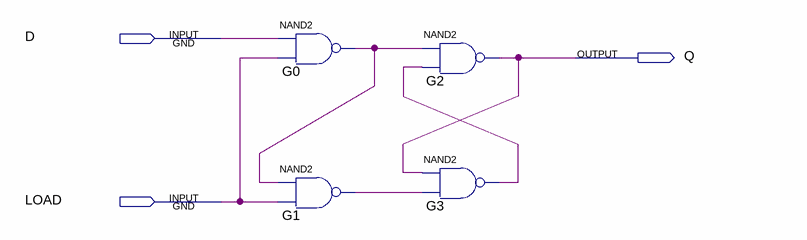
[diagram p0: schematic sheet]
// Quartus schematic dflipflop.bdf as structural Verilog: 4 symbols, 3 pins
module dflipflop (
  input  D,
  input  LOAD,
  output Q
);

  wire G0_out, G1_out, G3_out;

  nand G0 (G0_out, D, LOAD);
  nand G1 (G1_out, G0_out, LOAD);
  nand G2 (Q, G0_out, G3_out);
  nand G3 (G3_out, Q, G1_out);
endmodule
